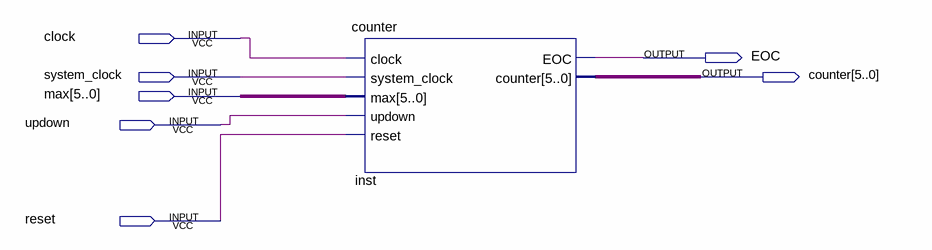
[diagram p0: schematic sheet]
// Quartus schematic counter_test.bdf as structural Verilog: 1 symbols, 7 pins
module counter_test (
  input  clock,
  input  system_clock,
  input  [5:0] max,
  input  updown,
  input  reset,
  output EOC,
  output [5:0] counter
);

  counter inst (
    .clock(clock), .system_clock(system_clock), .max(max), .updown(updown), .reset(reset), .EOC(EOC),
    .counter(counter));
endmodule
